# EAGLE design UV_lamp (EAGLE 9.6.2)
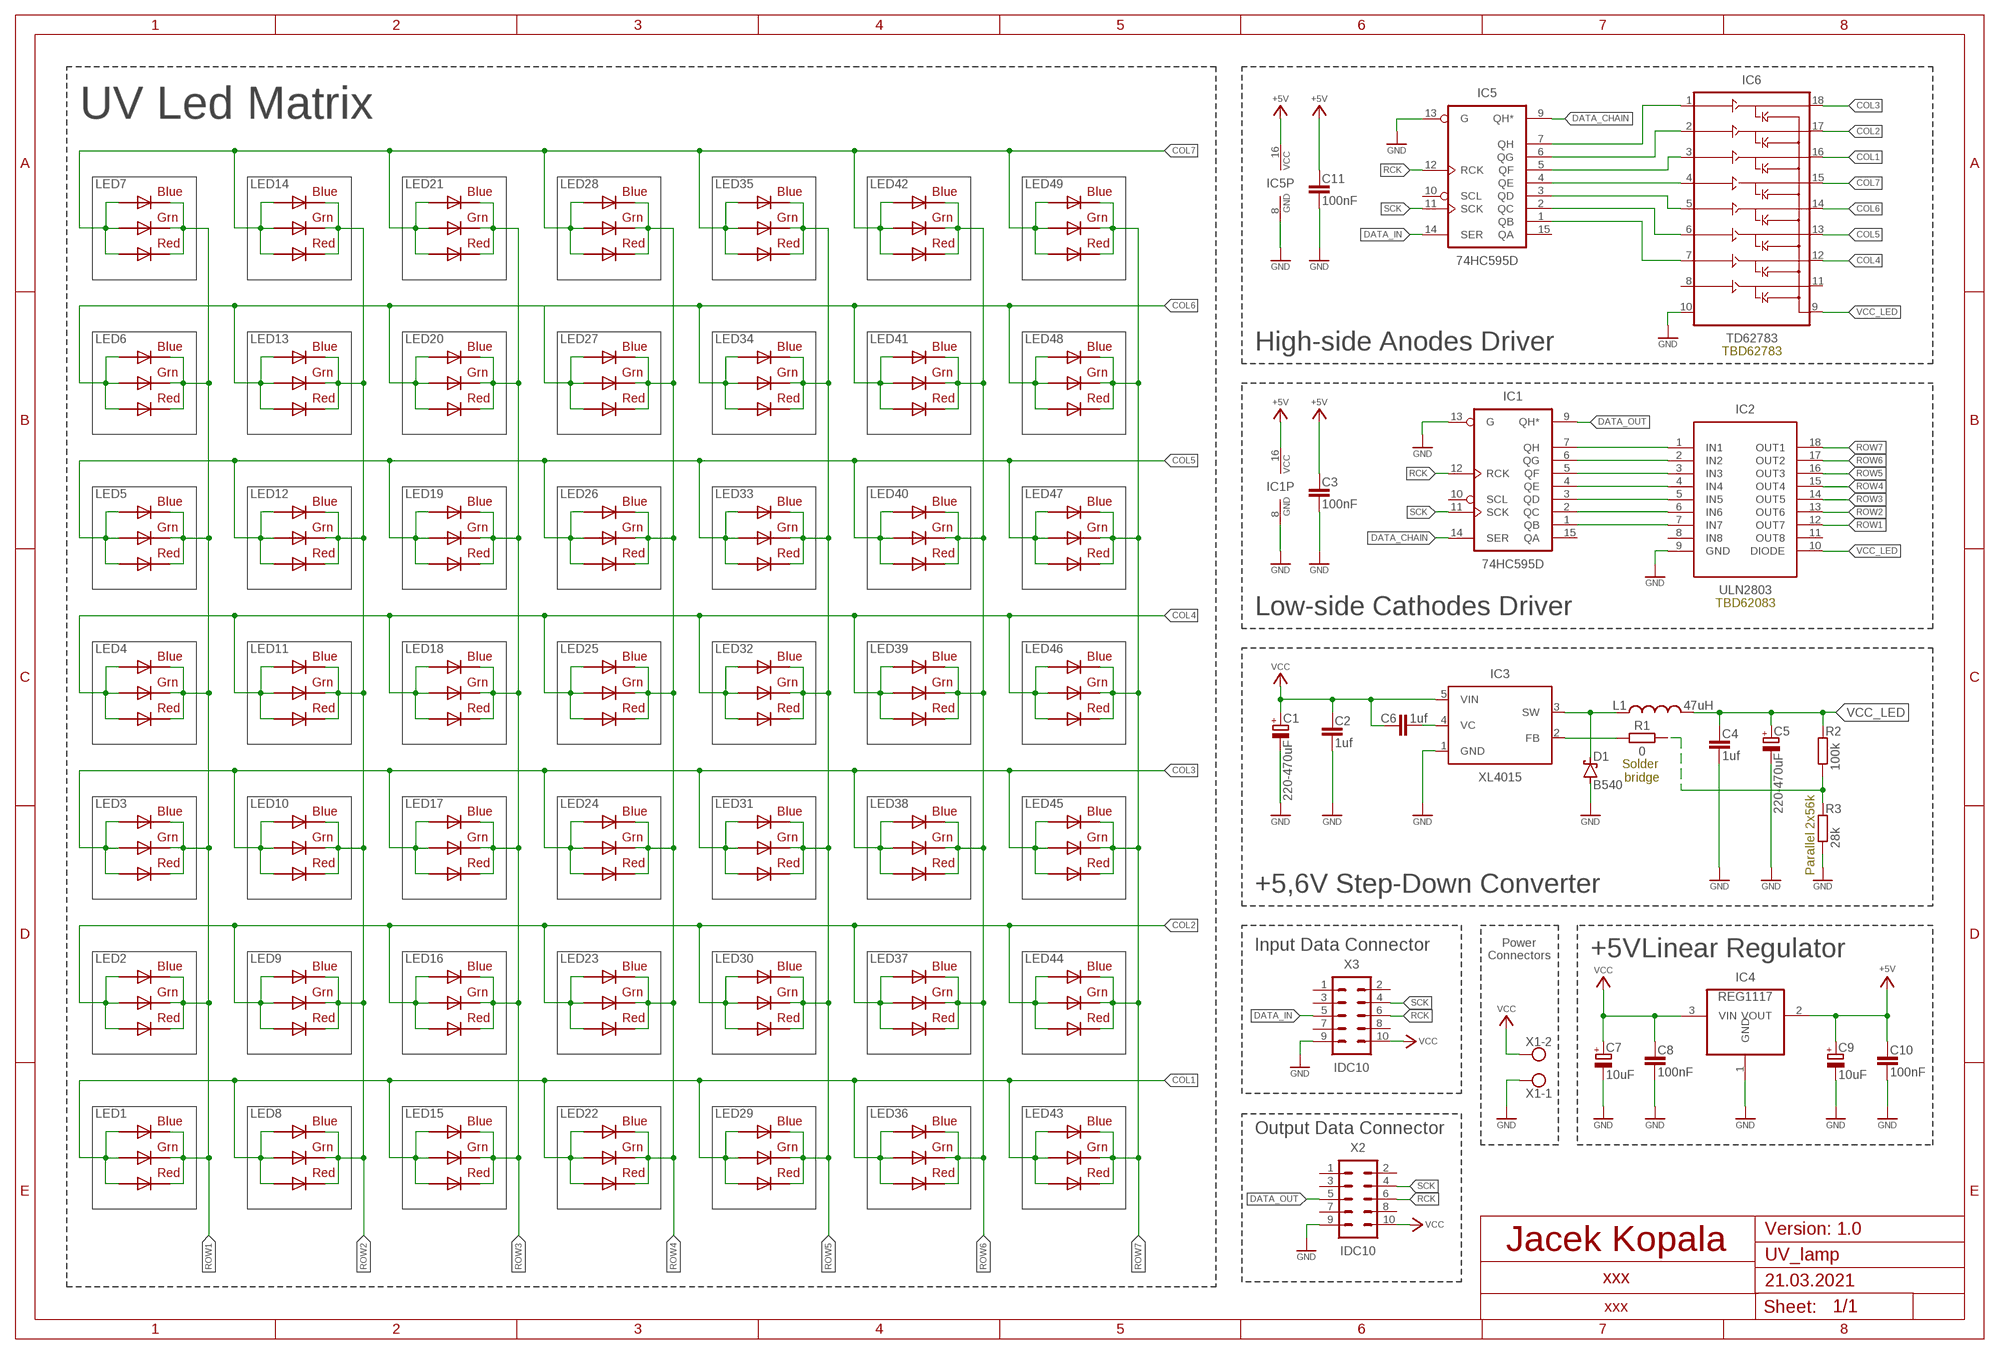
[diagram p0: schematic, sheet 1]

## Parts
C1  220-470uF  CPOL-EU140CLH-1010  [140CLH-1010]
C2  1uf  C-EUC0805  [C0805]
C3  100nF  C-EUC0805  [C0805]
C4  1uf  C-EUC0805  [C0805]
C5  220-470uF  CPOL-EU140CLH-1010  [140CLH-1010]
C6  1uf  C-EUC0805  [C0805]
C7  10uF  CPOL-EU153CLV-0405  [153CLV-0405]
C8  100nF  C-EUC0805  [C0805]
C9  10uF  CPOL-EU153CLV-0405  [153CLV-0405]
C10  100nF  C-EUC0805  [C0805]
C11  100nF  C-EUC0805  [C0805]
D1  B540  MBRS340T3  [SMC]
IC1  74HC595D  [SO16]
IC2  ULN2803  [SO18L]
IC3  XL4015  [TO263-5]
IC4  REG1117  [SOT223]
IC5  74HC595D  [SO16]
IC6  TD62783  IC_TD62783-SO-18W  [SO-18L]
L1  47uH  L-USTJ5-U1  [TJ5-U1]
LED1  RGBLED5050  [RGBLED5050]
LED2  RGBLED5050  [RGBLED5050]
LED3  RGBLED5050  [RGBLED5050]
LED4  RGBLED5050  [RGBLED5050]
LED5  RGBLED5050  [RGBLED5050]
LED6  RGBLED5050  [RGBLED5050]
LED7  RGBLED5050  [RGBLED5050]
LED8  RGBLED5050  [RGBLED5050]
LED9  RGBLED5050  [RGBLED5050]
LED10  RGBLED5050  [RGBLED5050]
LED11  RGBLED5050  [RGBLED5050]
LED12  RGBLED5050  [RGBLED5050]
LED13  RGBLED5050  [RGBLED5050]
LED14  RGBLED5050  [RGBLED5050]
LED15  RGBLED5050  [RGBLED5050]
LED16  RGBLED5050  [RGBLED5050]
LED17  RGBLED5050  [RGBLED5050]
LED18  RGBLED5050  [RGBLED5050]
LED19  RGBLED5050  [RGBLED5050]
LED20  RGBLED5050  [RGBLED5050]
LED21  RGBLED5050  [RGBLED5050]
LED22  RGBLED5050  [RGBLED5050]
LED23  RGBLED5050  [RGBLED5050]
LED24  RGBLED5050  [RGBLED5050]
LED25  RGBLED5050  [RGBLED5050]
LED26  RGBLED5050  [RGBLED5050]
LED27  RGBLED5050  [RGBLED5050]
LED28  RGBLED5050  [RGBLED5050]
LED29  RGBLED5050  [RGBLED5050]
LED30  RGBLED5050  [RGBLED5050]
LED31  RGBLED5050  [RGBLED5050]
LED32  RGBLED5050  [RGBLED5050]
LED33  RGBLED5050  [RGBLED5050]
LED34  RGBLED5050  [RGBLED5050]
LED35  RGBLED5050  [RGBLED5050]
LED36  RGBLED5050  [RGBLED5050]
LED37  RGBLED5050  [RGBLED5050]
LED38  RGBLED5050  [RGBLED5050]
LED39  RGBLED5050  [RGBLED5050]
LED40  RGBLED5050  [RGBLED5050]
LED41  RGBLED5050  [RGBLED5050]
LED42  RGBLED5050  [RGBLED5050]
LED43  RGBLED5050  [RGBLED5050]
LED44  RGBLED5050  [RGBLED5050]
LED45  RGBLED5050  [RGBLED5050]
LED46  RGBLED5050  [RGBLED5050]
LED47  RGBLED5050  [RGBLED5050]
LED48  RGBLED5050  [RGBLED5050]
LED49  RGBLED5050  [RGBLED5050]
R1  0  R-EU_R0805  [R0805]
R2  100k  R-EU_R0805  [R0805]
R3  28k  R-EU_R0805  [R0805]
X1  AK500/2  [AK500/2]
X2  IDC10  [ML10]
X3  IDC10  [ML10]

## Nets
+5V: C3.1 C9.+ C10.1 C11.1 IC1.16(VCC) IC4.2(VOUT) IC5.16(VCC)
COL1: IC6.16(OUT3) LED1.1(GREEN_A) LED1.2(RED_A) LED1.3(BLUE_A) LED8.1(GREEN_A) LED8.2(RED_A) LED8.3(BLUE_A) LED15.1(GREEN_A) LED15.2(RED_A) LED15.3(BLUE_A) LED22.1(GREEN_A) LED22.2(RED_A) LED22.3(BLUE_A) LED29.1(GREEN_A) LED29.2(RED_A) LED29.3(BLUE_A) LED36.1(GREEN_A) LED36.2(RED_A) LED36.3(BLUE_A) LED43.1(GREEN_A) LED43.2(RED_A) LED43.3(BLUE_A)
COL2: IC6.17(OUT2) LED2.1(GREEN_A) LED2.2(RED_A) LED2.3(BLUE_A) LED9.1(GREEN_A) LED9.2(RED_A) LED9.3(BLUE_A) LED16.1(GREEN_A) LED16.2(RED_A) LED16.3(BLUE_A) LED23.1(GREEN_A) LED23.2(RED_A) LED23.3(BLUE_A) LED30.1(GREEN_A) LED30.2(RED_A) LED30.3(BLUE_A) LED37.1(GREEN_A) LED37.2(RED_A) LED37.3(BLUE_A) LED44.1(GREEN_A) LED44.2(RED_A) LED44.3(BLUE_A)
COL3: IC6.18(OUT1) LED3.1(GREEN_A) LED3.2(RED_A) LED3.3(BLUE_A) LED10.1(GREEN_A) LED10.2(RED_A) LED10.3(BLUE_A) LED17.1(GREEN_A) LED17.2(RED_A) LED17.3(BLUE_A) LED24.1(GREEN_A) LED24.2(RED_A) LED24.3(BLUE_A) LED31.1(GREEN_A) LED31.2(RED_A) LED31.3(BLUE_A) LED38.1(GREEN_A) LED38.2(RED_A) LED38.3(BLUE_A) LED45.1(GREEN_A) LED45.2(RED_A) LED45.3(BLUE_A)
COL4: IC6.12(OUT7) LED4.1(GREEN_A) LED4.2(RED_A) LED4.3(BLUE_A) LED11.1(GREEN_A) LED11.2(RED_A) LED11.3(BLUE_A) LED18.1(GREEN_A) LED18.2(RED_A) LED18.3(BLUE_A) LED25.1(GREEN_A) LED25.2(RED_A) LED25.3(BLUE_A) LED32.1(GREEN_A) LED32.2(RED_A) LED32.3(BLUE_A) LED39.1(GREEN_A) LED39.2(RED_A) LED39.3(BLUE_A) LED46.1(GREEN_A) LED46.2(RED_A) LED46.3(BLUE_A)
COL5: IC6.13(OUT6) LED5.1(GREEN_A) LED5.2(RED_A) LED5.3(BLUE_A) LED12.1(GREEN_A) LED12.2(RED_A) LED12.3(BLUE_A) LED19.1(GREEN_A) LED19.2(RED_A) LED19.3(BLUE_A) LED26.1(GREEN_A) LED26.2(RED_A) LED26.3(BLUE_A) LED33.1(GREEN_A) LED33.2(RED_A) LED33.3(BLUE_A) LED40.1(GREEN_A) LED40.2(RED_A) LED40.3(BLUE_A) LED47.1(GREEN_A) LED47.2(RED_A) LED47.3(BLUE_A)
COL6: IC6.14(OUT5) LED6.1(GREEN_A) LED6.2(RED_A) LED6.3(BLUE_A) LED13.1(GREEN_A) LED13.2(RED_A) LED13.3(BLUE_A) LED20.1(GREEN_A) LED20.2(RED_A) LED20.3(BLUE_A) LED27.1(GREEN_A) LED27.2(RED_A) LED27.3(BLUE_A) LED34.1(GREEN_A) LED34.2(RED_A) LED34.3(BLUE_A) LED41.1(GREEN_A) LED41.2(RED_A) LED41.3(BLUE_A) LED48.1(GREEN_A) LED48.2(RED_A) LED48.3(BLUE_A)
COL7: IC6.15(OUT4) LED7.1(GREEN_A) LED7.2(RED_A) LED7.3(BLUE_A) LED14.1(GREEN_A) LED14.2(RED_A) LED14.3(BLUE_A) LED21.1(GREEN_A) LED21.2(RED_A) LED21.3(BLUE_A) LED28.1(GREEN_A) LED28.2(RED_A) LED28.3(BLUE_A) LED35.1(GREEN_A) LED35.2(RED_A) LED35.3(BLUE_A) LED42.1(GREEN_A) LED42.2(RED_A) LED42.3(BLUE_A) LED49.1(GREEN_A) LED49.2(RED_A) LED49.3(BLUE_A)
DATA_CHAIN: IC1.14(SER) IC5.9(QH*)
DATA_IN: IC5.14(SER) X3.5
DATA_OUT: IC1.9(QH*) X2.5
GND: C1.- C2.2 C3.2 C4.2 C5.- C7.- C8.2 C9.- C10.2 C11.2 D1.A IC1.8(GND) IC1.13(G) IC2.9(GND) IC3.1(GND) IC4.1(GND) IC5.8(GND) IC5.13(G) IC6.10(VS) R3.1 X1.1 X2.9 X3.9
N$1: IC1.7(QH) IC2.1(IN1)
N$2: IC1.6(QG) IC2.2(IN2)
N$4: IC1.5(QF) IC2.3(IN3)
N$5: IC5.4(QE) IC6.4(IN4)
N$6: IC1.4(QE) IC2.4(IN4)
N$7: IC1.3(QD) IC2.5(IN5)
N$8: IC1.2(QC) IC2.6(IN6)
N$9: IC1.1(QB) IC2.7(IN7)
N$10: IC5.3(QD) IC6.5(IN5)
N$11: IC5.2(QC) IC6.6(IN6)
N$12: IC5.1(QB) IC6.7(IN7)
N$13: IC5.5(QF) IC6.3(IN3)
N$14: IC5.6(QG) IC6.2(IN2)
N$15: IC5.7(QH) IC6.1(IN1)
N$19: C6.1 IC3.4(VC)
N$20: D1.C IC3.3(SW) L1.1
N$21: IC3.2(FB) R1.2
N$22: R1.1 R2.1 R3.2
RCK: IC1.12(RCK) IC5.12(RCK) X2.6 X3.6
ROW1: IC2.12(OUT7) LED1.4(BLUE_C) LED1.5(RED_C) LED1.6(GREEN_C) LED2.4(BLUE_C) LED2.5(RED_C) LED2.6(GREEN_C) LED3.4(BLUE_C) LED3.5(RED_C) LED3.6(GREEN_C) LED4.4(BLUE_C) LED4.5(RED_C) LED4.6(GREEN_C) LED5.4(BLUE_C) LED5.5(RED_C) LED5.6(GREEN_C) LED6.4(BLUE_C) LED6.5(RED_C) LED6.6(GREEN_C) LED7.4(BLUE_C) LED7.5(RED_C) LED7.6(GREEN_C)
ROW2: IC2.13(OUT6) LED8.4(BLUE_C) LED8.5(RED_C) LED8.6(GREEN_C) LED9.4(BLUE_C) LED9.5(RED_C) LED9.6(GREEN_C) LED10.4(BLUE_C) LED10.5(RED_C) LED10.6(GREEN_C) LED11.4(BLUE_C) LED11.5(RED_C) LED11.6(GREEN_C) LED12.4(BLUE_C) LED12.5(RED_C) LED12.6(GREEN_C) LED13.4(BLUE_C) LED13.5(RED_C) LED13.6(GREEN_C) LED14.4(BLUE_C) LED14.5(RED_C) LED14.6(GREEN_C)
ROW3: IC2.14(OUT5) LED15.4(BLUE_C) LED15.5(RED_C) LED15.6(GREEN_C) LED16.4(BLUE_C) LED16.5(RED_C) LED16.6(GREEN_C) LED17.4(BLUE_C) LED17.5(RED_C) LED17.6(GREEN_C) LED18.4(BLUE_C) LED18.5(RED_C) LED18.6(GREEN_C) LED19.4(BLUE_C) LED19.5(RED_C) LED19.6(GREEN_C) LED20.4(BLUE_C) LED20.5(RED_C) LED20.6(GREEN_C) LED21.4(BLUE_C) LED21.5(RED_C) LED21.6(GREEN_C)
ROW4: IC2.15(OUT4) LED22.4(BLUE_C) LED22.5(RED_C) LED22.6(GREEN_C) LED23.4(BLUE_C) LED23.5(RED_C) LED23.6(GREEN_C) LED24.4(BLUE_C) LED24.5(RED_C) LED24.6(GREEN_C) LED25.4(BLUE_C) LED25.5(RED_C) LED25.6(GREEN_C) LED26.4(BLUE_C) LED26.5(RED_C) LED26.6(GREEN_C) LED27.4(BLUE_C) LED27.5(RED_C) LED27.6(GREEN_C) LED28.4(BLUE_C) LED28.5(RED_C) LED28.6(GREEN_C)
ROW5: IC2.16(OUT3) LED29.4(BLUE_C) LED29.5(RED_C) LED29.6(GREEN_C) LED30.4(BLUE_C) LED30.5(RED_C) LED30.6(GREEN_C) LED31.4(BLUE_C) LED31.5(RED_C) LED31.6(GREEN_C) LED32.4(BLUE_C) LED32.5(RED_C) LED32.6(GREEN_C) LED33.4(BLUE_C) LED33.5(RED_C) LED33.6(GREEN_C) LED34.4(BLUE_C) LED34.5(RED_C) LED34.6(GREEN_C) LED35.4(BLUE_C) LED35.5(RED_C) LED35.6(GREEN_C)
ROW6: IC2.17(OUT2) LED36.4(BLUE_C) LED36.5(RED_C) LED36.6(GREEN_C) LED37.4(BLUE_C) LED37.5(RED_C) LED37.6(GREEN_C) LED38.4(BLUE_C) LED38.5(RED_C) LED38.6(GREEN_C) LED39.4(BLUE_C) LED39.5(RED_C) LED39.6(GREEN_C) LED40.4(BLUE_C) LED40.5(RED_C) LED40.6(GREEN_C) LED41.4(BLUE_C) LED41.5(RED_C) LED41.6(GREEN_C) LED42.4(BLUE_C) LED42.5(RED_C) LED42.6(GREEN_C)
ROW7: IC2.18(OUT1) LED43.4(BLUE_C) LED43.5(RED_C) LED43.6(GREEN_C) LED44.4(BLUE_C) LED44.5(RED_C) LED44.6(GREEN_C) LED45.4(BLUE_C) LED45.5(RED_C) LED45.6(GREEN_C) LED46.4(BLUE_C) LED46.5(RED_C) LED46.6(GREEN_C) LED47.4(BLUE_C) LED47.5(RED_C) LED47.6(GREEN_C) LED48.4(BLUE_C) LED48.5(RED_C) LED48.6(GREEN_C) LED49.4(BLUE_C) LED49.5(RED_C) LED49.6(GREEN_C)
SCK: IC1.11(SCK) IC5.11(SCK) X2.4 X3.4
VCC: C1.+ C2.1 C6.2 C7.+ C8.1 IC3.5(VIN) IC4.3(VIN) X1.2 X2.10 X3.10
VCC_LED: C4.1 C5.+ IC2.10(DIODE) IC6.9(GND) L1.2 R2.2
Unconnected: IC1.10(SCL) IC1.15(QA) IC2.8(IN8) IC2.11(OUT8) IC5.10(SCL) IC5.15(QA) IC6.8(IN8) IC6.11(OUT8) X2.1 X2.2 X2.3 X2.7 X2.8 X3.1 X3.2 X3.3 X3.7 X3.8

## Notes on the sheet
- UV Led Matrix
- High-side Anodes Driver | TBD62783
- TBD62083
- Low-side Cathodes Driver
- Solder 
  bridge
- Parallel 2x56k
- +5,6V Step-Down Converter
- Input Data Connector
- Power
  Connectors
- +5VLinear Regulator
- Output Data Connector
- Jacek Kopala | Version: 1.0
- xxx
- 21.03.2021
- xxx

## Library data of the parts
C1 C5 C7 C9 = rcl:CPOL-EU: POLARIZED CAPACITOR, European symbol; SPICEPREFIX: C
C2-C4 C6 C8 C10 C11 = rcl:C-EU: CAPACITOR, European symbol; SPICEPREFIX: C
D1 = diode:MBRS3*0T3: SCHOTTKY BARRIER RECTIFIER 3.0 AMPERES 20, 30, 40 VOLT Source: MBRS340T3-D.pdf
IC1 IC5 = 74xx-eu:74*595: 8-bit SHIFT REGISTER, output latch
IC2 = uln2803:ULN2803
IC3 = custom_jatsekku:XL4015
IC4 = burr-brown:REG1117: 800mA and 1A Low Dropout (LDO) Positive Regulator 1.8V, 2.5V, 2.85V, 3.3V, 5V, and Adj; MPN: REG1117; OC_FARNELL: 1097566; OC_NEWARK: 14P6981
IC6 = dp_devices:IC_TD62783: 8 Channel High voltage Source driver Mfr no: TD62783 TD62783AFG <http://www.digikey.com/product-detail/en/TD62783AFG%28O,S%29/TD62783AFG%28OS%29-ND/871116>
L1 = rcl:L-US: INDUCTOR, American symbol; SPICEPREFIX: L
LED1-LED49 = adafruit:RGBLED: For 5050 RGB LEDs, the order of the LEDs may vary from one manufacturer to another!
R1-R3 = rcl:R-EU_: RESISTOR, European symbol; SPICEPREFIX: R
X1 = con-ptr500:AK500/2: CONNECTOR; OC_FARNELL: unknown; OC_NEWARK: unknown
X2 X3 = custom_jatsekku:IDC10

## Board
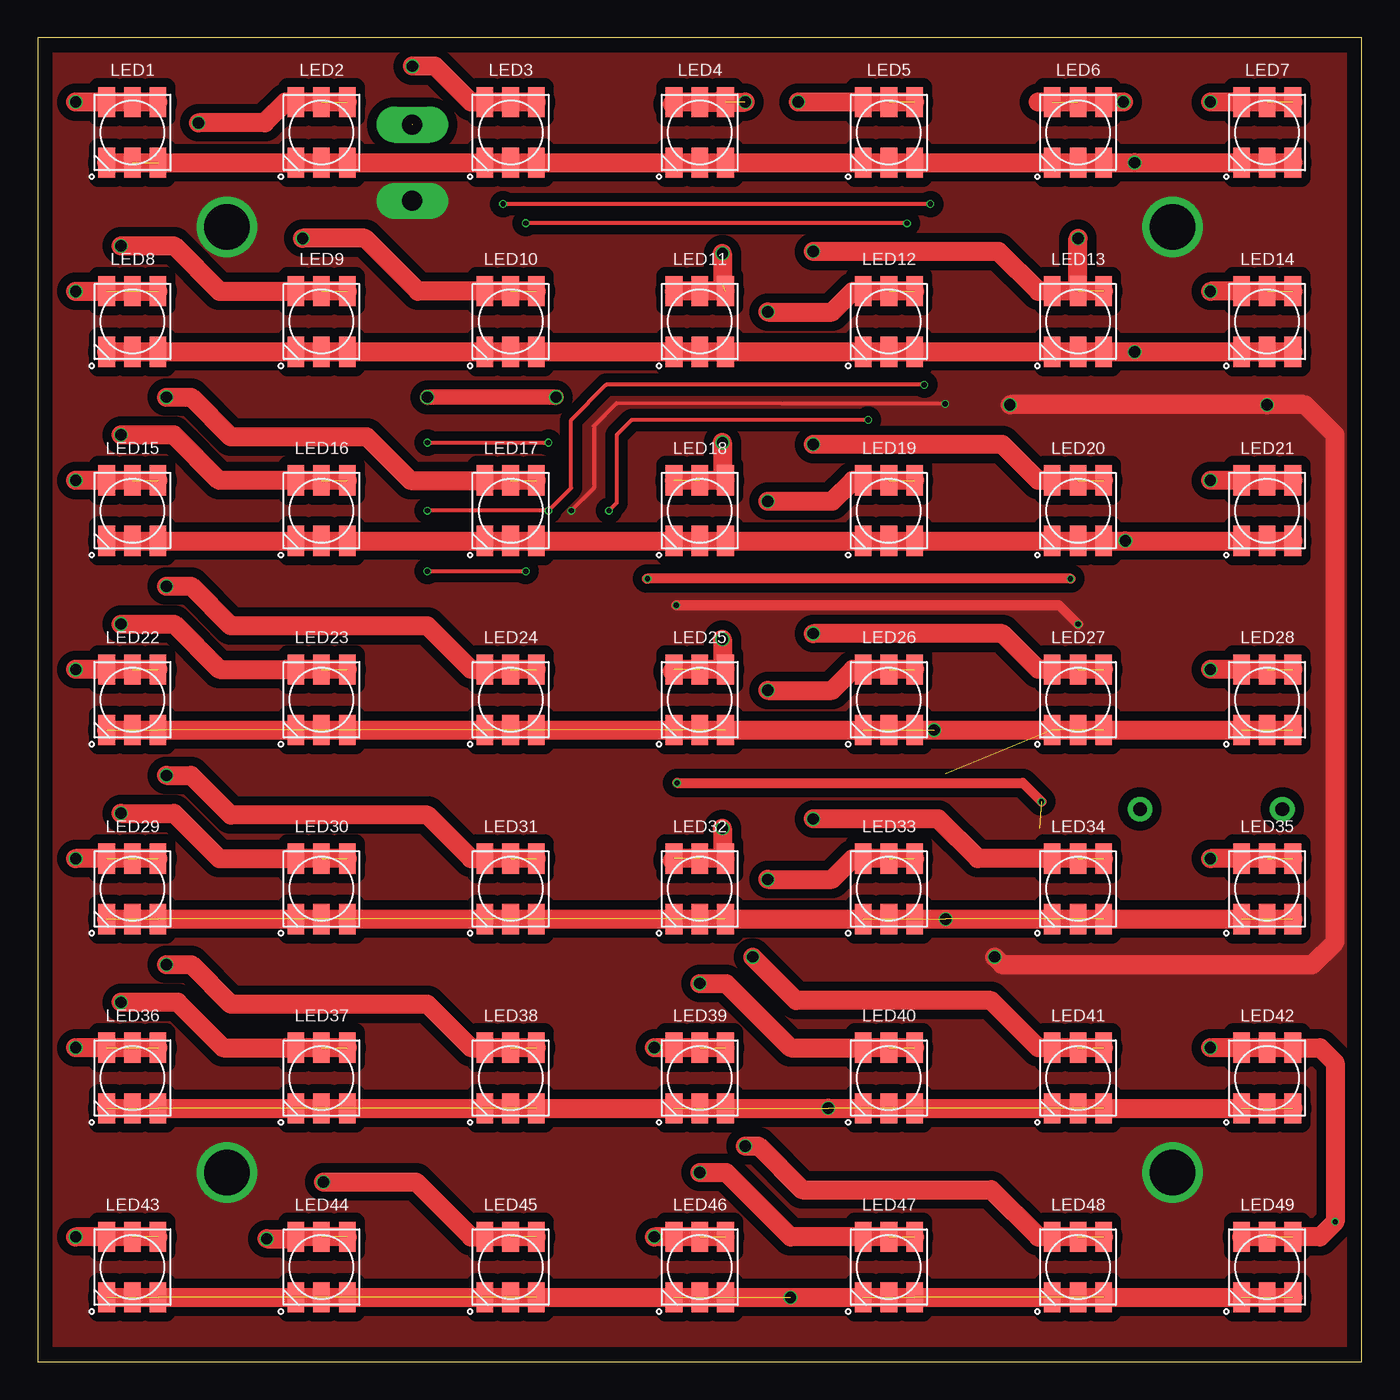
[diagram p1: board, top side]
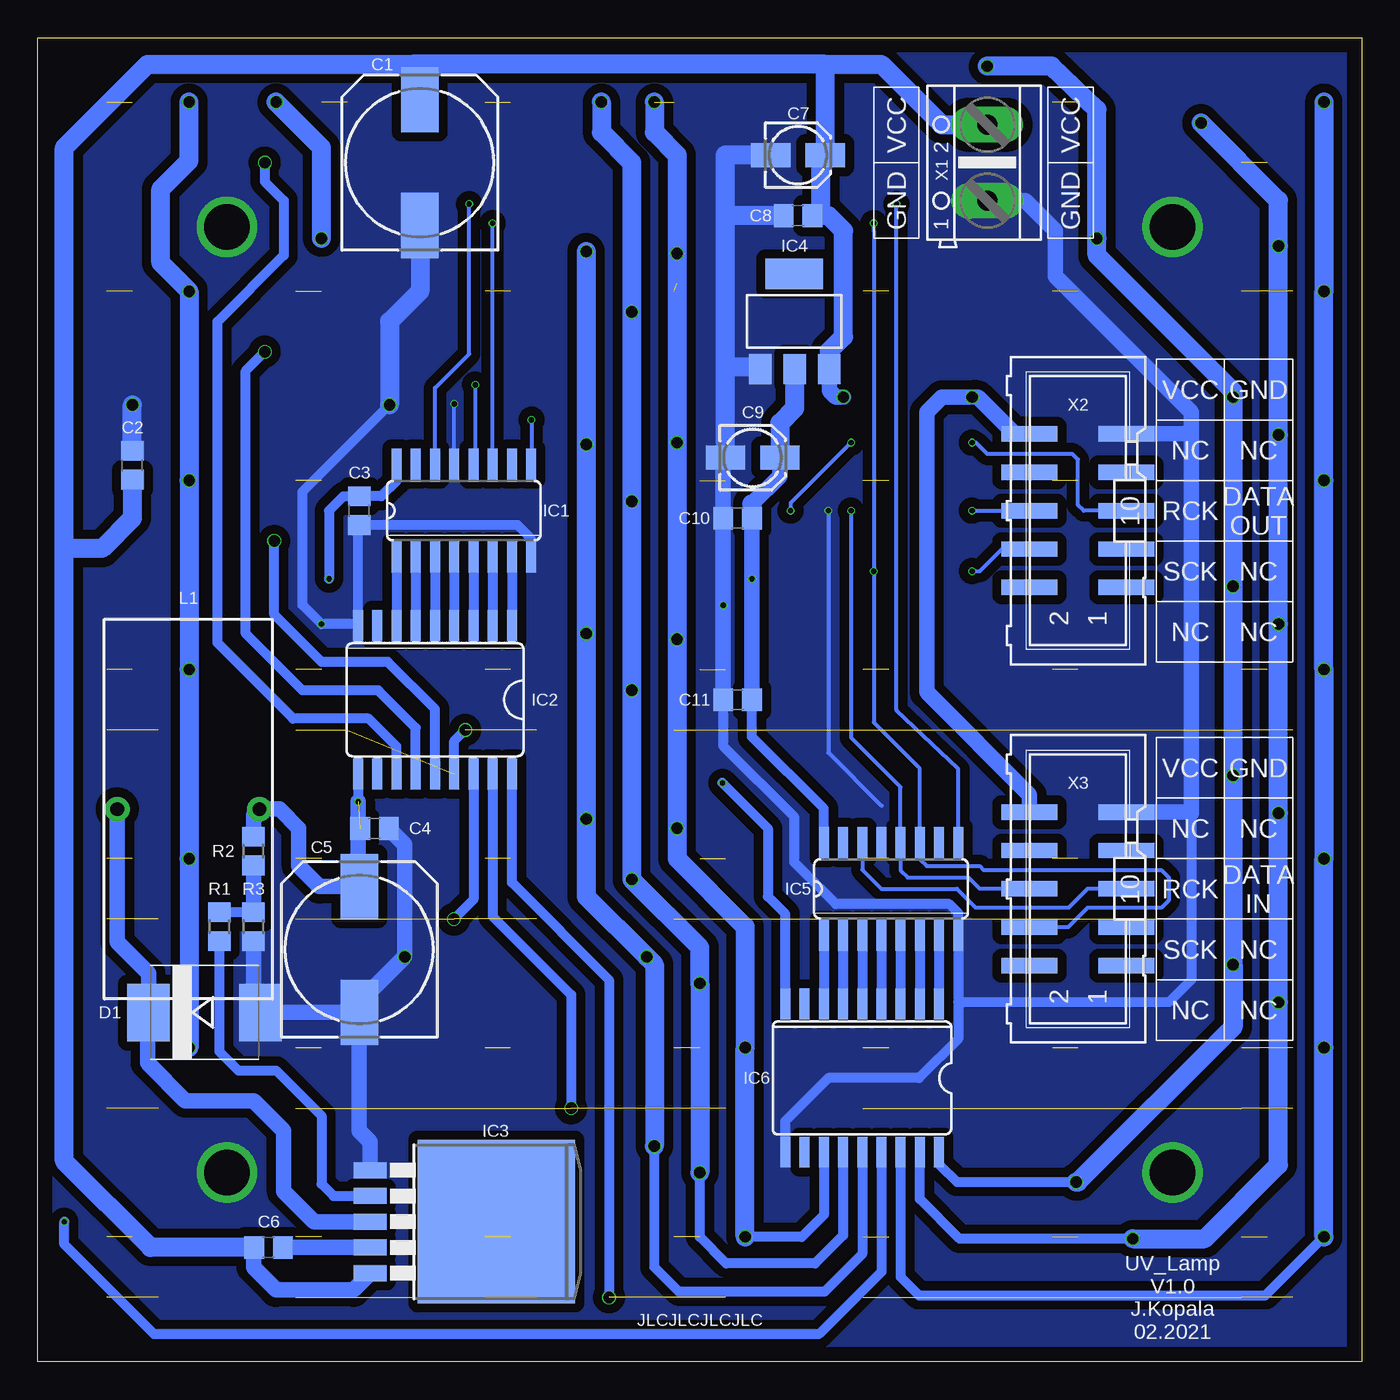
[diagram p2: board, bottom side, seen from below]

Size 87.5 x 87.5 mm. Coordinates in mm from the lower left corner, seen from the top.
Outline: 0,0 87.5,0 87.5,87.5 0,87.5 0,0
Copper layers (1*16): Top 0.035mm / dielectric 1.6mm / Bottom 0.035mm
Design rules "jlcpcb-2layers": minimum track width 5mil, minimum drill 0.3mm, track to track 5mil, track to pad 5mil, pad to pad 5mil, via to via 5mil, smd to smd 5mil, copper to edge 0.2mm, drill to drill 6mil, minimum pad ring 10mil, minimum via ring 3mil, stop-mask expansion 4mil, vias tented up to drill 0mil, thermal gap 10mil

### Footprints (pad centres in the part's own frame; a part is rotated, then mirrored left to right if it is on the bottom)
140CLH-1010 = smd 4.3 x 2.5: + 4.15,0; - -4.15,0
C0805 = smd 1.3 x 1.5: 1 -0.95,0; 2 0.95,0
153CLV-0405 = smd 2.6 x 1.6: + 1.8,0; - -1.8,0
SMC = smd 2.8 x 3.8: A 3.7,0; C -3.7,0
SO16 = smd 0.66 x 2.032: 1 -4.445,-3.073; 2 -3.175,-3.073; 3 -1.905,-3.073; 4 -0.635,-3.073; 5 0.635,-3.073; 6 1.905,-3.073; 7 3.175,-3.073; 8 4.445,-3.073; 9 4.445,3.073; 10 3.175,3.073; 11 1.905,3.073; 12 0.635,3.073; 13 -0.635,3.073; 14 -1.905,3.073; 15 -3.175,3.073; 16 -4.445,3.073
SO18L = smd 0.66 x 2.032: 1 -5.08,-4.902; 2 -3.81,-4.902; 3 -2.54,-4.902; 4 -1.27,-4.902; 5 0,-4.902; 6 1.27,-4.902; 7 2.54,-4.902; 8 3.81,-4.902; 9 5.08,-4.902; 10 5.08,4.902; 11 3.81,4.902; 12 2.54,4.902; 13 1.27,4.902; 14 0,4.902; 15 -1.27,4.902; 16 -2.54,4.902; 17 -3.81,4.902; 18 -5.08,4.902
TO263-5 = smd 1.067 x 2.159: 1 -3.404,-5.791; 2 -1.702,-5.791; 3 0,-5.791; 4 1.702,-5.791; 5 3.404,-5.791 | smd 10.8 x 10.41: 6 0,2.54
SOT223 = smd 1.499 x 2.007: 1 -2.261,-3.15; 2 0.025,-3.15; 3 2.311,-3.15 | smd 3.81 x 2.007: 4 0,3.15
SO-18L = smd 0.66 x 2.032: 1 -4.445,-4.902; 2 -3.175,-4.902; 3 -1.905,-4.902; 4 -0.635,-4.902; 5 0.635,-4.902; 6 1.905,-4.902; 7 3.175,-4.902; 8 4.445,-4.902; 9 5.715,-4.902; 10 5.715,4.902; 11 4.445,4.902; 12 3.175,4.902; 13 1.905,4.902; 14 0.635,4.902; 15 -0.635,4.902; 16 -1.905,4.902; 17 -3.175,4.902; 18 -4.445,4.902
TJ5-U1 = drill 0.9: 1 -4.7,0; 2 4.7,0
RGBLED5050 = smd 2 x 1.1: 1 -2,1.7; 2 -2,0; 3 -2,-1.7; 4 2,-1.7; 5 2,0; 6 2,1.7
R0805 = smd 1.3 x 1.5: 1 -0.95,0; 2 0.95,0
AK500/2 = drill 1.321 long: 1 -2.515,0; 2 2.515,0
ML10 = smd 1.02 x 3.7: 1 -5.08,-3.2; 2 -5.08,3.2; 3 -2.54,-3.2; 4 -2.54,3.2; 5 0,-3.2; 6 0,3.2; 7 2.54,-3.2; 8 2.54,3.2; 9 5.08,-3.2; 10 5.08,3.2

### Placement (x,y rotation side)
C1  62.25,79.25 90 bottom
C2  81.25,59.25 90 bottom
C3  66.25,56.25 270 bottom
C4  65.25,35.25 0 bottom
C5  66.25,27.25 90 bottom
C6  72.25,7.55 180 bottom
C7  37.25,79.75 0 bottom
C8  37.25,75.75 180 bottom
C9  40.25,59.75 0 bottom
C10  41.25,55.75 180 bottom
C11  41.25,43.75 180 bottom
D1  76.48,23.08 0 bottom
IC1  59.34,56.25 0 bottom
IC2  61.25,43.75 180 bottom
IC3  59.75,9.25 270 bottom
IC4  37.5,68.75 0 bottom
IC5  31.11,31.25 0 bottom
IC6  32.38,18.75 180 bottom
L1  77.55,36.52 0 bottom
LED1  6.25,81.25 270 top
LED2  18.75,81.25 270 top
LED3  31.25,81.25 270 top
LED4  43.75,81.25 270 top
LED5  56.25,81.25 270 top
LED6  68.75,81.25 270 top
LED7  81.25,81.25 270 top
LED8  6.25,68.75 270 top
LED9  18.75,68.75 270 top
LED10  31.25,68.75 270 top
LED11  43.75,68.75 270 top
LED12  56.25,68.75 270 top
LED13  68.75,68.75 270 top
LED14  81.25,68.75 270 top
LED15  6.25,56.25 270 top
LED16  18.75,56.25 270 top
LED17  31.25,56.25 270 top
LED18  43.75,56.25 270 top
LED19  56.25,56.25 270 top
LED20  68.75,56.25 270 top
LED21  81.25,56.25 270 top
LED22  6.25,43.75 270 top
LED23  18.75,43.75 270 top
LED24  31.25,43.75 270 top
LED25  43.75,43.75 270 top
LED26  56.25,43.75 270 top
LED27  68.75,43.75 270 top
LED28  81.25,43.75 270 top
LED29  6.25,31.25 270 top
LED30  18.75,31.25 270 top
LED31  31.25,31.25 270 top
LED32  43.75,31.25 270 top
LED33  56.25,31.25 270 top
LED34  68.75,31.25 270 top
LED35  81.25,31.25 270 top
LED36  6.25,18.75 270 top
LED37  18.75,18.75 270 top
LED38  31.25,18.75 270 top
LED39  43.75,18.75 270 top
LED40  56.25,18.75 270 top
LED41  68.75,18.75 270 top
LED42  81.25,18.75 270 top
LED43  6.25,6.25 270 top
LED44  18.75,6.25 270 top
LED45  31.25,6.25 270 top
LED46  43.75,6.25 270 top
LED47  56.25,6.25 270 top
LED48  68.75,6.25 270 top
LED49  81.25,6.25 270 top
R1  75.5,28.75 270 bottom
R2  73.25,33.75 90 bottom
R3  73.25,28.75 90 bottom
X1  24.75,79.25 90 bottom
X2  18.75,56.25 90 bottom
X3  18.75,31.25 90 bottom

### Tracks (layer width: path | path; a pad name or v marks a point on that pad's centre or on a via)
+5V  (via drill 0.35)
  Top 0.66: v68.25,51.75 v40.3,51.75 40.26,51.75
  Bottom 0.66: IC1.16 63.79,58.21 64.8,57.2 C3.1 67.3,57.2 68.25,56.25 v68.25,51.75 | C11.1 40.3,41.3 35.55,36.55 IC5.16
  Bottom 1.016: C11.1 v40.3,51.75 C10.1 | C9.+ 38.45,58.55 40.3,56.7
  Bottom 1.27: 40.3,56.7 C10.1 | IC4.2 37.48,63.02 38.45,62.05 C9.+
COL1  (via drill 0.75)  (9 unrouted)
  Top 1.27: v2.5,70.75 LED8.1 | LED15.1 LED15.3 v2.5,58.25 | LED22.1 LED22.3 v2.5,45.75 | LED29.1 v2.5,33.25 | LED36.1 v2.5,20.75 | LED43.1 LED43.3 v2.5,8.25 | LED1.1 LED1.2 LED1.3 v2.5,83.25
  Bottom 0.66: IC6.16 30.47,5.59 29.25,4.38 6.38,4.38 v2.5,8.25
  Bottom 1.27: v2.5,83.25 v2.5,70.75 v2.5,58.25 v2.5,45.75 v2.5,33.25 v2.5,20.75 v2.5,8.25
COL2  (via drill 0.75)  (7 unrouted)
  Top 1.27: LED2.1 LED2.3 16.38,83.25 15,81.88 v10.62,81.88 | LED9.1 LED9.3 12,70.75 9,73.75 v5.5,73.75 | LED16.1 LED16.3 12,58.25 9,61.25 v5.5,61.25 | LED23.1 LED23.3 | LED30.1 LED30.3 | LED37.1 LED37.3 | LED44.1 LED44.3 16.93,8.12 v15.12,8.12 | LED23.3 16.43,45.75 | LED30.3 16.43,33.25 | LED37.3 16.38,20.75 | v5.5,48.75 9,48.75 12,45.75 LED23.3 | v5.5,36.25 9,36.25 12,33.25 LED30.3 | v5.5,23.75 9.25,23.75 12.25,20.75 LED37.3
  Bottom 0.66: IC6.17 29.2,10.75 26.57,8.12 v15.12,8.12
  Bottom 1.27: v10.62,81.88 5.5,76.75 v5.5,73.75 v5.5,61.25 v5.5,48.75 v5.5,36.25 v5.5,23.75 5.5,13 10.38,8.12 v15.12,8.12
COL3  (via drill 0.75)  (6 unrouted)
  Top 1.27: LED3.1 LED3.2 LED3.3 28.62,83.25 26.25,85.62 v24.75,85.62 | LED10.1 LED10.3 25.12,70.75 21.62,74.25 v17.5,74.25 | LED17.1 LED17.3 24.62,58.25 21.75,61.12 12.75,61.12 10.12,63.75 v8.5,63.75 | LED24.1 LED24.3 28.62,45.75 25.75,48.62 12.75,48.62 10.12,51.25 v8.5,51.25 | LED31.1 LED31.3 28.62,33.25 25.75,36.12 12.75,36.12 10.12,38.75 v8.5,38.75 | LED38.1 LED38.3 28.62,20.75 25.75,23.62 12.75,23.62 10.12,26.25 v8.5,26.25 | LED45.1 LED45.3 28.62,8.25 25,11.88 v18.88,11.88
  Bottom 0.66: IC6.18 27.93,13.05 26.75,11.88 v18.88,11.88
  Bottom 1.27: v18.88,11.88 18.75,11.88 8.5,22.12 v8.5,26.25 v8.5,38.75 v8.5,51.25 v8.5,63.75 8.5,64.12 17.5,73.12 v17.5,74.25 17.5,82.75 20.5,85.62 v24.75,85.62
COL4  (via drill 0.75)  (7 unrouted)
  Top 1.27: LED11.1 LED11.2 LED11.3 | LED18.3 LED18.1 45.25,58.45 v45.25,60.75 | LED39.1 LED39.3 v40.75,20.75 | LED46.1 LED46.3 v40.75,8.25 | 41.92,83.12 LED4.3 LED4.1 45.25,83.45 | 41.92,33.12 LED32.3 LED32.1 45.25,33.45 v45.25,35.25 | 41.92,45.62 LED25.3 LED25.1 45.25,45.95 v45.25,47.75 | v45.25,73.25 45.25,71.25 | LED4.2 v46.75,83.25
  Bottom 0.66: v40.75,8.25 37,8.25 35.55,9.7 IC6.12
  Bottom 1.27: v40.75,8.25 v40.75,20.75 40.75,28.75 45.25,33.25 v45.25,35.25 v45.25,47.75 v45.25,60.75 v45.25,73.25 45.25,79.75 46.75,81.25 v46.75,83.25
COL5  (via drill 0.75)  (7 unrouted)
  Top 1.27: LED5.1 LED5.3 v50.25,83.25 | LED12.1 LED12.3 53.88,70.75 52.5,69.38 v48.25,69.38 | LED19.1 LED19.3 53.88,58.25 52.5,56.88 v48.25,56.88 | LED26.1 LED26.3 53.88,45.75 52.5,44.38 v48.25,44.38 | LED33.1 LED33.3 53.88,33.25 52.5,31.88 v48.25,31.88 | LED40.1 LED40.3 49.75,20.75 45.5,25 v43.75,25 | LED47.1 LED47.3 49.75,8.25 45.5,12.5 v43.75,12.5
  Bottom 0.66: IC6.13 34.28,8.34 36.12,6.5 42,6.5 43.75,8.25 v43.75,12.5
  Bottom 1.27: v43.75,12.5 v43.75,25 43.75,27.38 v48.25,31.88 v48.25,44.38 v48.25,56.88 v48.25,69.38 48.25,79.25 50.25,81.25 v50.25,83.25
COL6  (via drill 0.75)  (7 unrouted)
  Top 1.27: LED6.3 69.75,83.25 LED6.1 v71.75,83.25 | LED13.1 LED13.3 66.12,70.75 63.5,73.38 v51.25,73.38 | LED20.1 LED20.3 66.12,58.25 63.75,60.62 v51.25,60.62 | LED27.1 LED27.3 66.12,45.75 63.75,48.12 v51.25,48.12 | LED34.1 LED34.3 62.12,33.25 59.5,35.88 v51.25,35.88 | LED41.1 LED41.3 66.12,20.75 63,23.88 50.12,23.88 v47.25,26.75 | LED48.1 LED48.3 66.12,8.25 63,11.38 50.5,11.38 47.62,14.25 v46.75,14.25 | LED6.3 66.75,83.25 | LED6.3 66.12,83.25 | LED13.2 v68.75,74.25
  Bottom 0.66: IC6.14 33.01,7.12 35.5,4.62 45.12,4.62 46.75,6.25 v46.75,14.25
  Bottom 1.27: v51.25,73.38 v51.25,60.62 v51.25,48.12 v51.25,35.88 51.25,30.75 v47.25,26.75 46.75,26.25 v46.75,14.25 | v68.75,74.25 68.75,80.25 v71.75,83.25
COL7  (via drill 0.35, 0.75)  (5 unrouted)
  Top 1.27: LED7.1 LED7.3 v77.5,83.25 | LED14.1 LED14.3 v77.5,70.75 | LED21.1 LED21.2 LED21.3 v77.5,58.25 | LED28.1 LED28.3 v77.5,45.75 | LED35.1 LED35.3 v77.5,33.25 | LED49.3 LED49.1 84.75,8.25 v85.75,9.25 85.75,19.75 84.75,20.75 LED42.1 LED42.2 LED42.3 v77.5,20.75
  Bottom 0.66: IC6.15 31.74,5.96 35.88,1.82 79.82,1.82 85.75,7.75 v85.75,9.25
  Bottom 1.27: v77.5,20.75 v77.5,33.25 v77.5,45.75 v77.5,58.25 v77.5,70.75 79.38,72.62 79.38,77.5 77.5,79.38 v77.5,83.25
DATA_CHAIN  (via drill 0.35)
  Top 0.254: v58.99,76.52 v30.75,76.52
  Bottom 0.254: IC1.14 61.25,64.35 58.99,66.61 v58.99,76.52 | IC5.9 26.66,39.16 30.75,43.05 v30.75,76.52
DATA_IN
  Bottom 0.254: IC5.14 33.01,32.51 31.75,31.25 26.75,31.25 25.5,30 19.38,30 18.12,31.25 X3.5
DATA_OUT  (via drill 0.35)
  Top 0.254: v25.75,60.75 v33.75,60.75 | v37.75,56.25 38.25,56.75 38.25,61.25 39.25,62.25 v54.88,62.25
  Bottom 0.254: v25.75,60.75 25.5,60.75 24.75,60 19.12,60 18.75,59.62 18.75,56.62 18.38,56.25 X2.5 | v33.75,60.75 37.75,56.75 v37.75,56.25 | v54.88,62.25 54.88,59.35 IC1.9
GND  (via drill 0.35, 0.75, 3 pad 4.02)
  Top 0.254: v59.98,63.3 38.25,63.35 36.75,61.85 36.75,57.75 v35.25,56.25
  Top 0.66: v68.75,48.75 67.5,50 v42.2,50
  Top 1.27: v63.25,26.75 63.75,26.25 84.25,26.25 85.75,27.75 85.75,61.25 83.75,63.25 v81.25,63.25 v64.25,63.25
  Bottom 0.254: IC1.13 v59.98,63.3 | 31.74,36.74 35.25,40.25 v35.25,56.25
  Bottom 0.66: IC1.8 54.9,54.4 55.8,55.3 C3.2 66.33,55.22 IC2.9 66.43,48.75 v68.75,48.75 70,50 70,57.5 v64.25,63.25 | IC6.10 38.09,15.91 35.25,18.75 29.25,18.75 26.66,21.34 26.66,23.75 | 26.66,23.75 IC5.8 26.66,29.66 27.25,30.25 34.75,30.25 37.5,33 37.5,36 42.2,40.7 C11.2 | C5.- 66.25,23.75 66.04,23.54 | 42.2,59.6 C9.- | 26.66,23.75 12.75,23.75 11.25,25.25 11.25,36.25
  Bottom 1: 66.25,21.75 66.75,22.25 66.75,22.6 C5.-
  Bottom 1.016: C4.2 63.25,34.2 v63.25,26.75 66.25,23.75 | C5.- 66.27,23.08 D1.A 73.25,23.55 R3.1 | IC3.1 65.54,14.54 66.25,15.25 66.25,21.75 | C11.2 v42.2,50 C10.2 42.2,59.6 | X3.9 11.33,36.33 11.25,36.25 11.25,61.25 | X2.9 11.33,61.33 11.25,61.25 | 11.25,61.25 11.25,62.75 20.25,71.75 20.25,74.75 22.23,76.73 X1.1
  Bottom 1.27: C1.- 62.25,70.75 64.25,68.75 v64.25,63.25 | C2.2 v81.25,63.25 | C9.- 42.05,65.75 | 42.05,65.75 42.05,75.75 | 42.05,75.75 42.05,79.75 C7.- | IC4.1 39.91,65.75 42.05,65.75 | C8.2 42.05,75.75
  other vias: 12.5,75 12.5,12.5 75,12.5 75,75
  pour Top (isolate 0.61, no thermals): 1,86.5 86.5,86.5 86.5,1 1,1
  pour Bottom (isolate 0.61, no thermals): 1,86.5 86.5,86.5 86.5,1 1,1
N$1
  Bottom 0.66: IC1.7 IC2.1
N$2
  Bottom 0.66: IC1.6 IC2.2
N$4
  Bottom 0.66: IC1.5 IC2.3
N$5
  Bottom 0.66: IC5.4 IC6.4
N$6
  Bottom 0.66: IC1.4 IC2.4
N$7
  Bottom 0.66: IC1.3 IC2.5
N$8
  Bottom 0.66: IC1.2 IC2.6
N$9
  Bottom 0.66: IC1.1 IC2.7
N$10
  Bottom 0.66: IC5.3 IC6.5
N$11
  Bottom 0.66: IC5.2 IC6.6
N$12
  Bottom 0.66: IC5.1 IC6.7
N$13
  Bottom 0.66: IC5.5 IC6.3
N$14
  Bottom 0.66: IC5.6 IC6.2
N$15
  Bottom 0.66: IC5.7 IC6.1
N$19
  Bottom 1.016: C6.1 IC3.4
N$20
  Bottom 0.66: 80.25,23.01 D1.C
  Bottom 1.016: L1.1 82.25,27.75 80.18,25.68 D1.C | IC3.3 69.25,9.25 71.25,11.25 71.25,15.25 73.25,17.25 77.75,17.25 80.25,19.75 80.25,23.01
N$21
  Bottom 0.66: R1.2 75.5,20.5 74.25,19.25 71.75,19.25 68.75,16.25 68.75,11.75 67.95,10.95 IC3.2
N$22
  Bottom 0.66: R3.2 75.48,29.7 R1.1
  Bottom 1.016: R2.1 R3.2
RCK  (via drill 0.35)
  Top 0.254: v58.59,64.57 37.57,64.57 35.25,62.25 35.25,57.75 v33.75,56.25 v25.75,56.25
  Bottom 0.254: v58.59,64.57 58.59,59.45 IC1.12 | v33.75,56.25 33.75,41.25 30.47,37.97 IC5.12 30.47,32.47 30,32 26,32 25.25,31.25 X3.6 | v25.75,56.25 X2.6
ROW1  (via drill 0.75)  (1 unrouted)
  Top 1.27: LED1.4 LED1.5 LED2.5 | LED2.4 LED2.5 | LED2.5 LED2.6 LED3.5 | LED3.4 LED3.5 | LED3.5 LED3.6 LED4.5 | LED4.4 LED4.5 | LED4.5 LED4.6 LED5.5 | LED5.4 LED5.5 | LED5.5 LED5.6 LED6.5 | LED6.4 LED6.5 | LED6.5 v72.5,79.25 | LED6.6 v72.5,79.25 | v72.5,79.25 LED7.5 | LED7.4 LED7.5 | LED7.5 LED7.6
  Bottom 0.66: IC2.12 63.79,40.66 65.62,42.5 70.62,42.5 75.62,47.5 75.62,68.75 71.25,73.12 71.25,76.75 72.5,78 v72.5,79.25
ROW2  (via drill 0.75)
  Top 1.27: v72.5,66.75 LED14.5 | LED8.4 LED8.5 LED8.6 LED9.5 | LED9.4 LED9.5 | LED9.5 LED9.6 LED10.5 | LED10.4 LED10.5 | LED10.5 LED10.6 LED11.5 | LED11.4 LED11.5 | LED11.5 LED11.6 LED12.5 | LED12.4 LED12.5 | LED12.5 LED12.6 LED13.5 | LED13.4 LED13.5 | LED13.5 v72.5,66.75 | LED13.6 v72.5,66.75 | LED14.4 LED14.5 | LED14.5 LED14.6
  Bottom 0.66: IC2.13 62.52,41.9 65,44.38 70,44.38 73.75,48.12 73.75,65.5 v72.5,66.75
ROW3  (via drill 0.75)
  Top 1.27: LED15.4 LED15.5 LED15.6 LED16.5 | LED16.4 LED16.5 | LED16.5 LED16.6 LED17.5 | LED17.4 LED17.5 | LED17.5 LED17.6 LED18.5 | LED18.4 LED18.5 | LED18.5 LED18.6 LED19.5 | LED19.4 LED19.5 | LED19.5 LED19.6 LED20.5 | LED20.4 LED20.5 | LED20.5 LED20.6 v71.88,54.25 LED21.5 | LED21.4 LED21.5 | LED21.5 LED21.6
  Bottom 0.66: IC2.14 61.25,43.12 64.38,46.25 68.75,46.25 71.88,49.38 v71.88,54.25
ROW4  (via drill 0.75)  (19 unrouted)
  Top 1.27: LED22.4 v59.25,41.75 LED28.6
  Bottom 0.66: IC2.15 59.98,41.02 v59.25,41.75
ROW5  (via drill 0.75)  (19 unrouted)
  Top 1.27: LED29.4 v60,29.25 LED35.6
  Bottom 0.66: IC2.16 58.71,30.54 v60,29.25
ROW6  (via drill 0.75)  (19 unrouted)
  Top 1.27: LED36.4 v52.25,16.75 LED42.6
  Bottom 0.66: IC2.17 57.44,29.44 52.25,24.25 v52.25,16.75
ROW7  (via drill 0.75)  (18 unrouted)
  Top 0.66: LED47.6 60.62,4.25
  Top 1.27: LED43.4 v49.75,4.25 60.62,4.25 LED49.6
  Bottom 0.66: IC2.18 56.17,31.67 49.75,25.25 v49.75,4.25
SCK  (via drill 0.35)
  Top 0.254: v57.44,75.25 v32.25,75.25 | v25.75,52.25 v32.25,52.25
  Bottom 0.254: IC1.11 v57.44,75.25 | v32.25,75.25 32.25,74.75 v32.25,52.25 32.25,42.25 29.2,39.2 IC5.11 29.2,33.2 28.75,32.75 25.25,32.75 25,32.5 13.25,32.5 12.75,32 12.75,30.5 13.25,30 18.12,30 19.41,28.71 X3.4 | X2.4 23.79,53.71 25.25,52.25 v25.75,52.25
VCC  (via drill 0.75)  (1 unrouted)
  Top 1.016: v25.75,63.75 v34.25,63.75
  Bottom 1.016: IC3.5 66.64,4.75 71.75,4.75 73.25,6.25 73.25,7.5 C6.2 | X2.10 22.95,61.33 25.37,63.75 v25.75,63.75 27.75,63.75 28.75,62.75 28.75,44.25 21.95,37.45 X3.10 | IC4.3 35.19,64.19 34.75,63.75 v34.25,63.75
  Bottom 1.27: C6.2 80.05,7.55 85.75,13.25 85.75,53.75 | 62.4,83.25 C1.+ 62.25,85.25 62.75,85.75 | 85.75,53.75 85.75,80.25 80.25,85.75 62.75,85.75 | C2.1 81.25,55.75 83.25,53.75 85.75,53.75 | 35.45,85.75 62.75,85.75 | IC4.3 35.19,66.81 34.25,67.75 34.25,74.75 35.25,75.75 C8.1 35.75,76.3 35.75,79.75 C7.+ 35.45,85.75 | 35.45,85.75 31.75,85.75 27.75,81.75 24.77,81.75
VCC_LED  (via drill 0.35)  (1 unrouted)
  Top 0.66: v66.33,37.02 65.1,38.25 v42.25,38.25
  Bottom 0.66: 66.33,31.48 C5.+ | IC2.10 v66.33,37.02 | IC6.9 38.09,29.59 39.25,30.75 39.25,35.25 v42.25,38.25
  Bottom 1.016: v66.33,37.02 66.33,31.48 | C5.+ 68.9,31.4 70.25,32.75 70.25,35.25 71.52,36.52 L1.2 73.25,36.12 R2.2

### Text on the board
bPlace: VCC | VCC | GND | GND | GND | VCC | NC | NC | DATA / OUT | RCK | NC | SCK | NC | NC | GND | VCC | NC | NC | DATA / IN | RCK | NC | SCK | NC | NC | UV_Lamp / V1.0 | J.Kopala / 02.2021 | JLCJLCJLCJLC